# Altium schematic sheet POWER.SchDoc
size A4
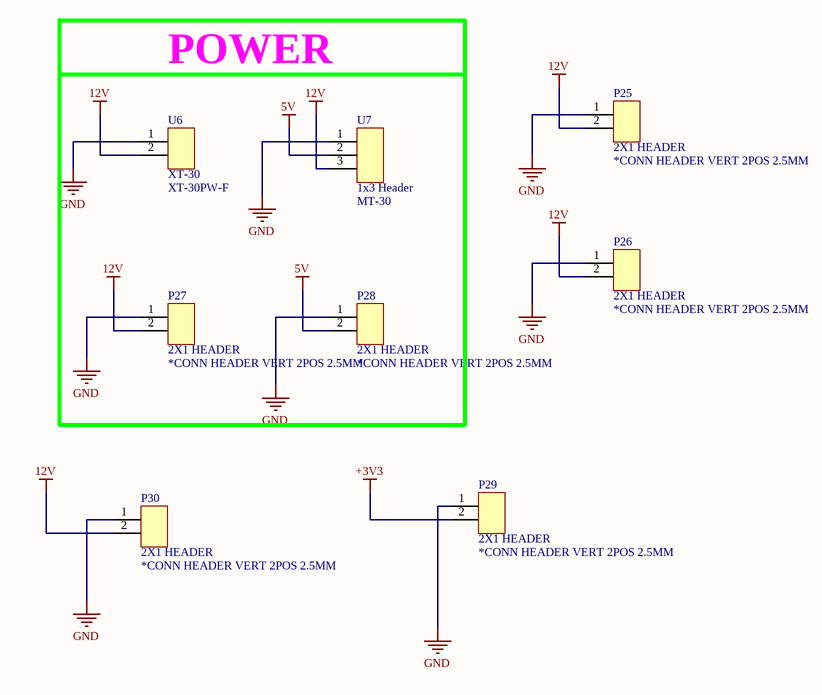
[diagram p0: POWER.SchDoc]

## Parts
P25  *CONN HEADER VERT 2POS 2.5MM  [51025-02-0100-01]
P26  *CONN HEADER VERT 2POS 2.5MM  [51025-02-0100-01]
P27  *CONN HEADER VERT 2POS 2.5MM  [51025-02-0100-01]
P28  *CONN HEADER VERT 2POS 2.5MM  [51025-02-0100-01]
P29  *CONN HEADER VERT 2POS 2.5MM  [51025-02-0100-01]
P30  *CONN HEADER VERT 2POS 2.5MM  [51025-02-0100-01]
U6  XT-30PW-F  [XT-30PW-F]
U7  MT-30  [MT-30]

## Blocks framed on the sheet
POWER: P27 P28 U6 U7

## Nets
5V: P28.2 U7.2
12V: P25.2 P26.2 P27.2 P30.2 U6.2 U7.3
+3V3: P29.2
GND: P25.1 P26.1 P27.1 P28.1 P29.1 P30.1 U6.1 U7.1

## Notes on the sheet
- (in symbol B2B-XH-AM(LF)(SN)) 2X1 HEADER
- (in symbol MT-30) 1x3 Header
- (in symbol XT-30PW-F) XT-30

## Library data of the parts
P25-P30 = B2B-XH-AM(LF)(SN): Conn Shrouded Header (4 Sides) HDR 2 POS 2.5mm Solder ST Top Entry Thru-Hole Box; Manufacturer: JST; Manufacturer Part Number: B2B-XH-A(LF)(SN); Number of Positions: 2; Connector Type: Male Pin; Contact Resistance: 20mR; Max Current Rating: 3A; Max Voltage Rating (AC): 250V; Insulation Resistance: 1GR; Wire/Cable Gauge: 22AWG; Supplier 1: RSComponents; RoHS: Yes; Category: Headers and Wire Housings; Stock 1: 7000; Mount: Through Hole; Contact Plating: Tin,Copper,Lead; Color: Natural; Contact Material: Brass; Housing Color: White; Housing Material: Polyamide; Min Operating Temperature: -25°C; Max Operating Temperature: 85°C; Number of Rows: 1; Packaging: Bulk; Termination: Solder; Fastening Type: Detent; Current Rating: 3A; Orientation: Straight; Voltage Rating: 250V; Voltage Rating (AC): 250V; Number of Contacts: 2; Max Voltage Rating (DC): 250V; Length: 7.4mm; Pitch: 2.5mm; Depth: 5.75mm; Lead Pitch: 2.5mm; Lead Free: Lead Free; REACH SVHC: No SVHC; ComponentLink1URL: https://datasheet.ciiva.com/26894/getdatasheetpartid-640357-26894434.pdf?src-supplier=Verical; ComponentLink1Description: https://datasheet.ciiva.com/26894/getdatasheetpartid-640357-26894434.pdf?src-supplier=Verical; ComponentLink2URL: https://datasheet.ciiva.com/11746/0900766b8082653e-11746979.pdf?src-supplier=RSComponents; ComponentLink2Description: https://datasheet.ciiva.com/11746/0900766b8082653e-11746979.pdf?src-supplier=RSComponents; ComponentLink3URL: https://datasheet.ciiva.com/26894/getdatasheetpartid-385291-26894760.pdf?src-supplier=Verical; ComponentLink3Description: https://datasheet.ciiva.com/26894/getdatasheetpartid-385291-26894760.pdf?src-supplier=Verical; ComponentLink4URL: https://datasheet.ciiva.com/8052/5448-8052024.pdf?src-supplier=Element14; ComponentLink4Description: https://datasheet.ciiva.com/8052/5448-8052024.pdf?src-supplier=Element14; ComponentLink5URL: https://datasheet.ciiva.com/20207/523653-20207167.pdf?src-supplier=Rapid+Electronics; ComponentLink5Description: https://datasheet.ciiva.com/20207/523653-20207167.pdf?src-supplier=Rapid+Electronics; Supplier 2: Digi-Key; Stock 2: 7636; Pricing 2: 1=0,17000, 10=0,13100, 100=0,09660, 500=0,07998, 1000=0,06999, 5000=0,05999, 10000=0,05832 (USD); ComponentLink6URL: https://datasheet.ciiva.com/26894/getdatasheetpartid-640409-26894436.pdf?src-supplier=Verical; ComponentLink6Description: https://datasheet.ciiva.com/26894/getdatasheetpartid-640409-26894436.pdf?src-supplier=Verical; ComponentLink7URL: https://datasheet.ciiva.com/14800/exh-14800590.pdf?src-supplier=Digi-Key; ComponentLink7Description: https://datasheet.ciiva.com/14800/exh-14800590.pdf?src-supplier=Digi-Key